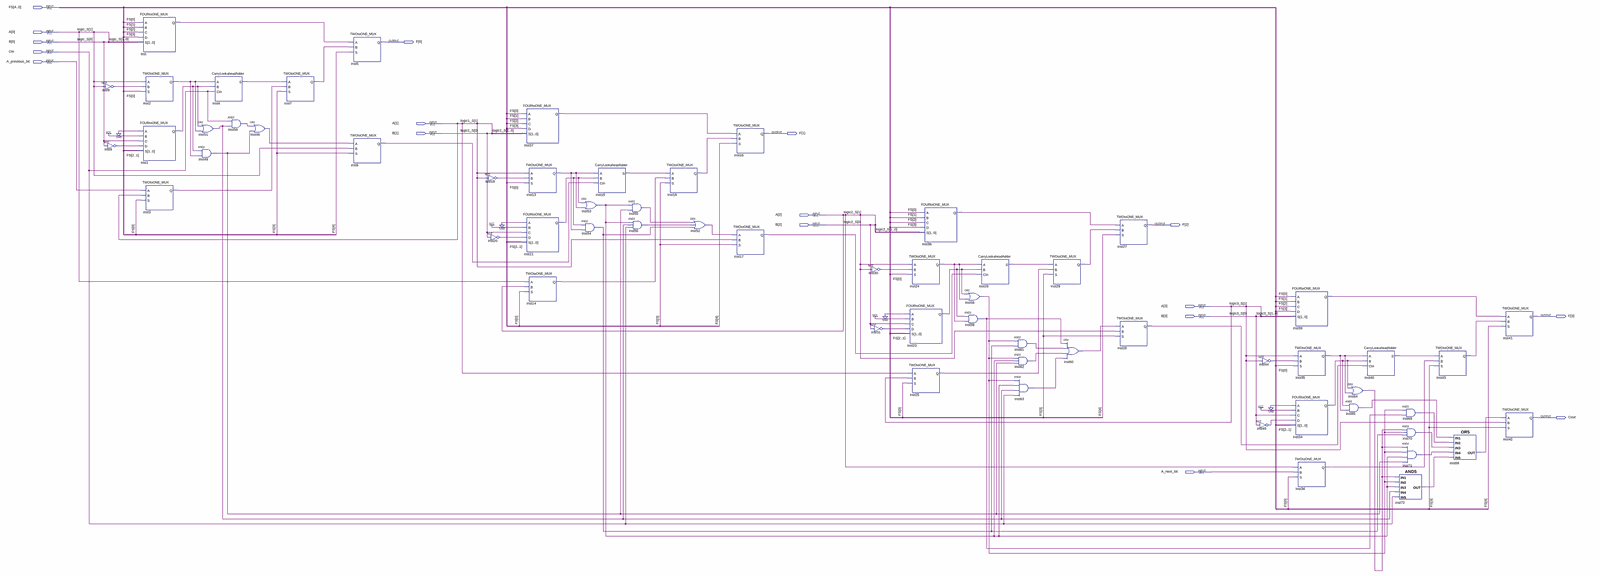
[diagram p0: schematic sheet, whole]
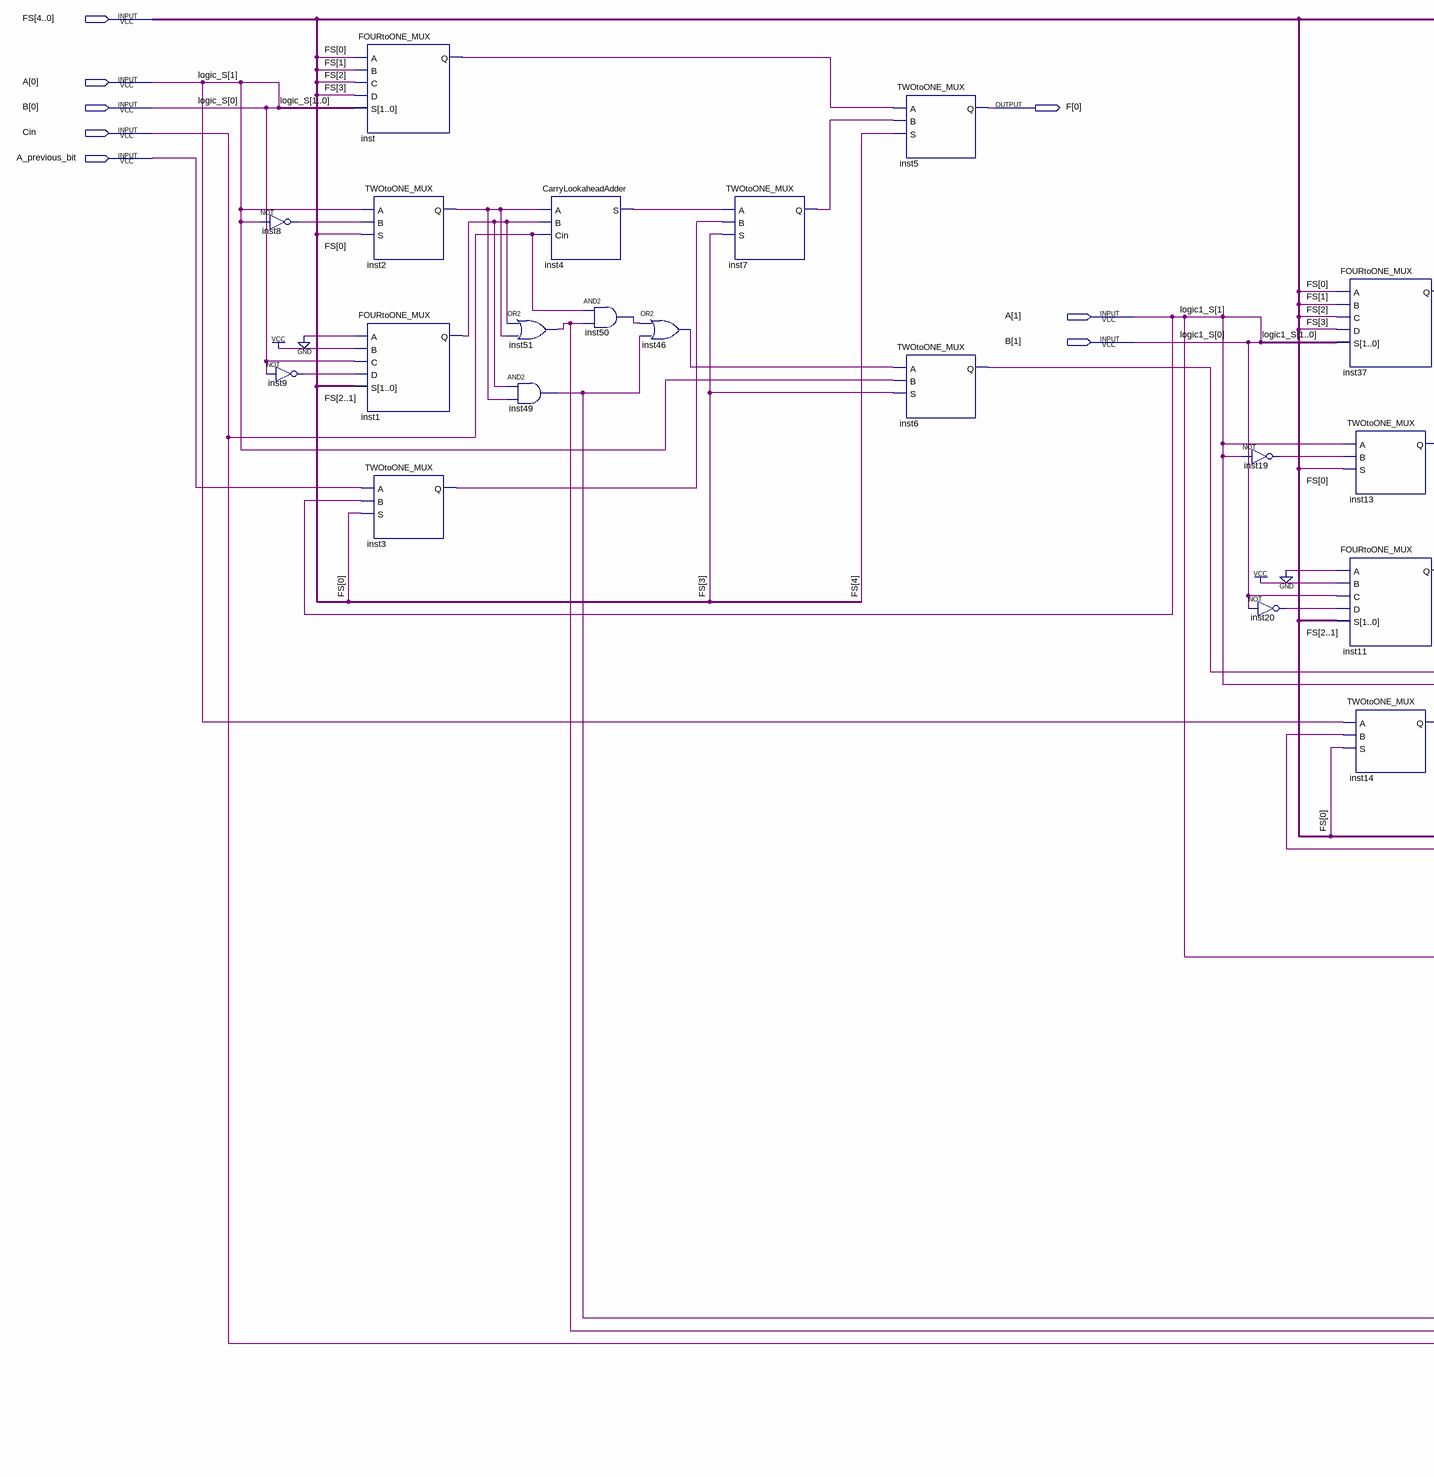
[diagram p1: schematic sheet, left part]
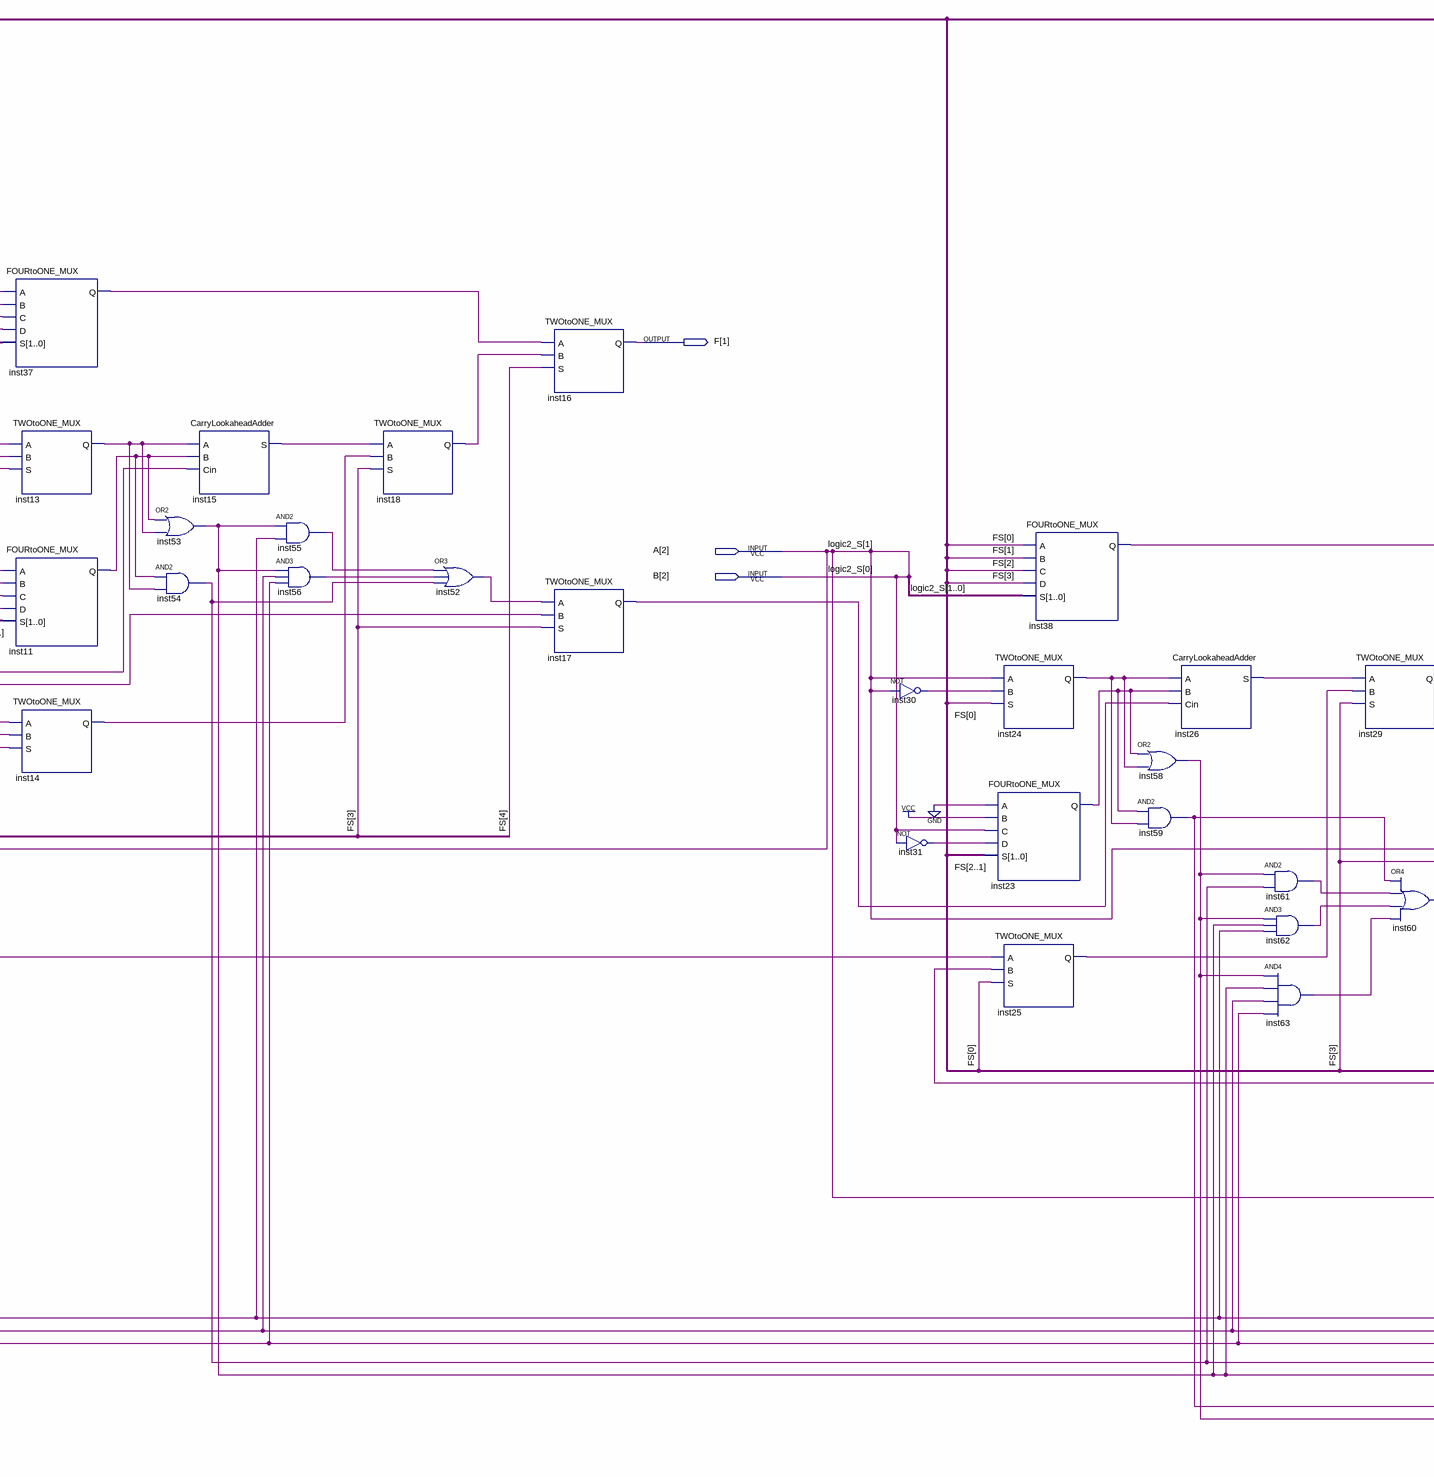
[diagram p2: schematic sheet, centre part]
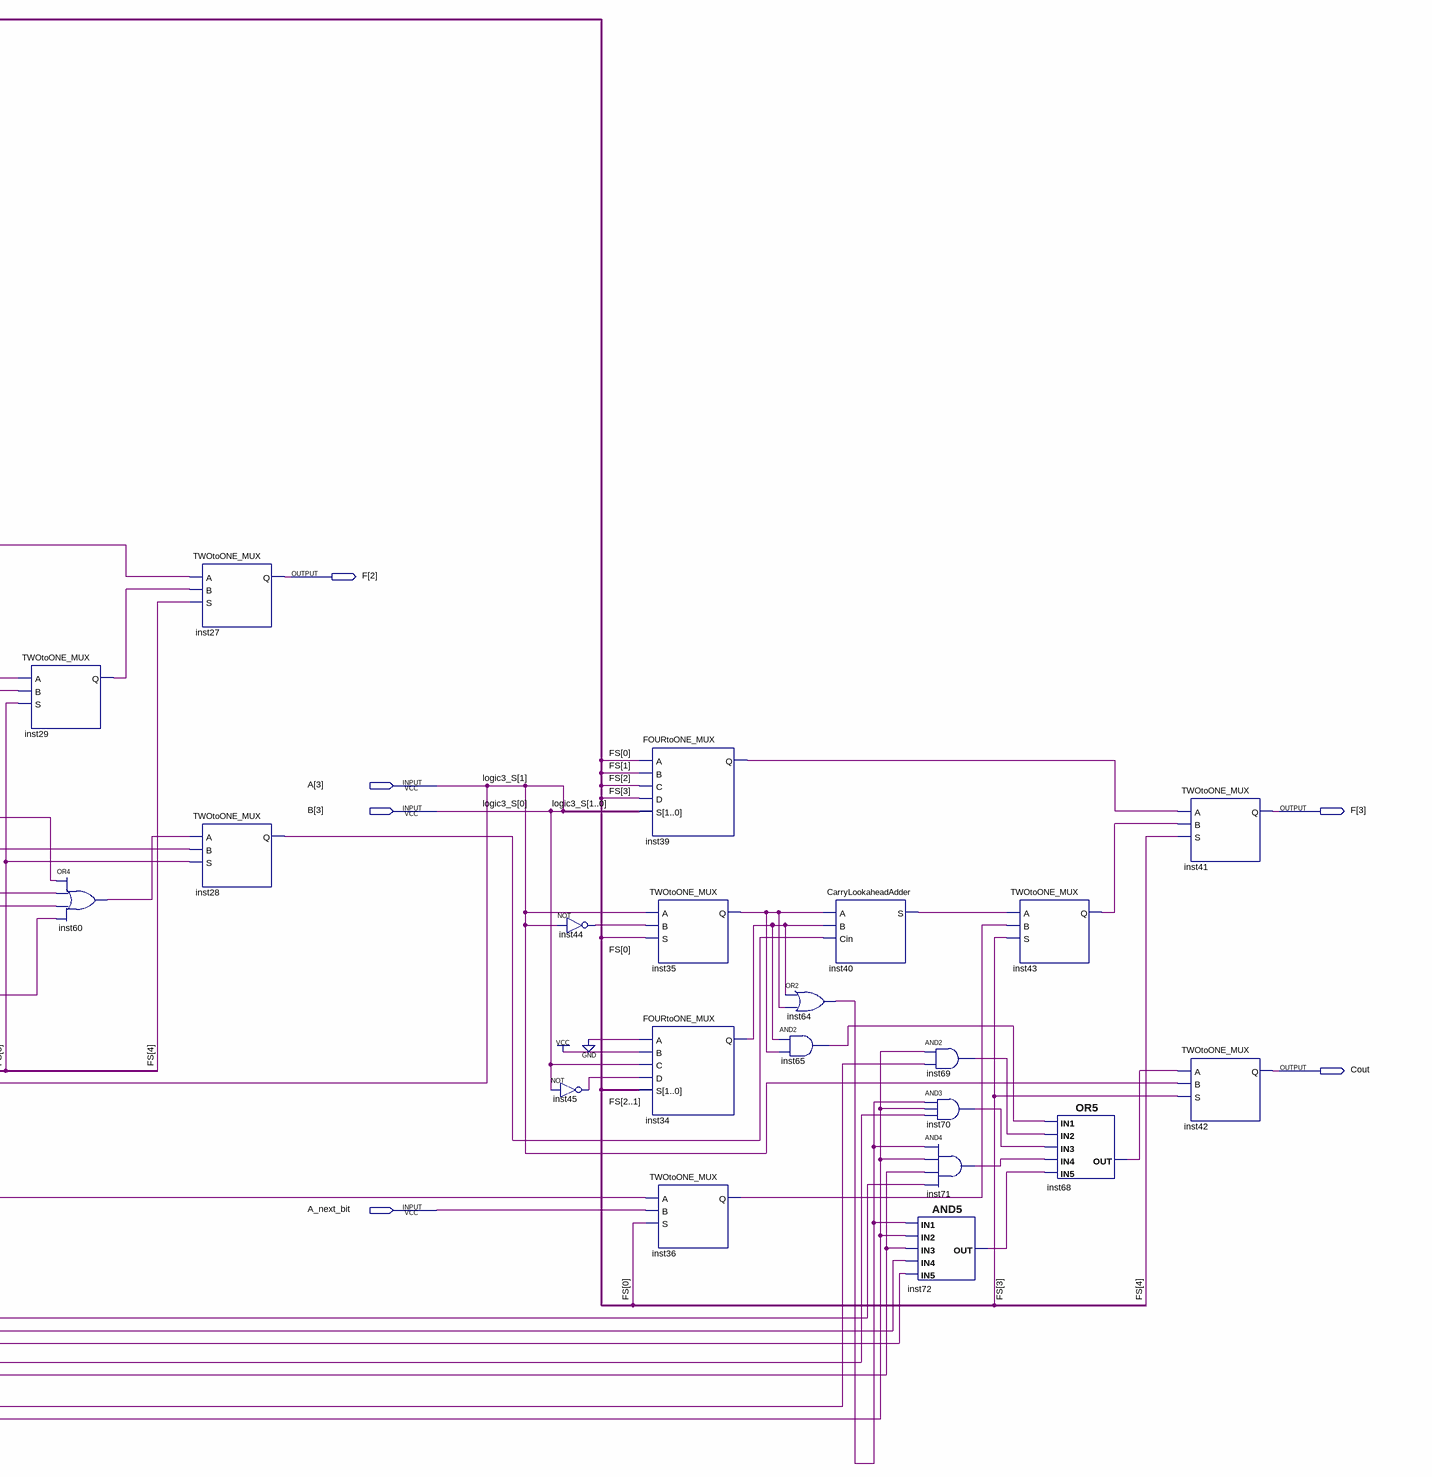
[diagram p3: schematic sheet, right part]
// Quartus schematic ALU_4bit.bdf as structural Verilog: 62 symbols, 17 pins
module ALU_4bit (
  input  [4:0] FS,
  input  [3:0] A,
  input  [3:0] B,
  input  Cin,
  input  A_previous_bit,
  input  A_next_bit,
  output [3:0] F,
  output Cout
);

  wire inst1_q, inst2_q, inst3_q, inst4_s, inst6_q, inst7_q, inst8_out, inst9_out, inst11_q, inst13_q,
       inst14_q, inst15_s, inst17_q, inst18_q, inst19_out, inst20_out, inst23_q, inst24_q, inst25_q,
       inst26_s, inst28_q, inst29_q, inst30_out, inst31_out, inst34_q, inst35_q, inst36_q, inst37_q,
       inst38_q, inst39_q, inst40_s, inst43_q, inst44_out, inst45_out, inst46_out, inst49_out, inst50_out,
       inst51_out, inst52_out, inst53_out, inst54_out, inst55_out, inst56_out, inst58_out, inst59_out,
       inst60_out, inst61_out, inst62_out, inst63_out, inst64_out, inst65_out, inst68_out, inst69_out,
       inst70_out, inst71_out, inst72_out, inst_q;

  not inst8 (inst8_out, A[0]);
  not inst9 (inst9_out, B[0]);
  FOURtoONE_MUX inst (.A(FS[0]), .B(FS[1]), .C(FS[2]), .D(FS[3]), .S({A[0], B[0]}), .Q(inst_q));
  TWOtoONE_MUX inst2 (.A(A[0]), .B(inst8_out), .S(FS[0]), .Q(inst2_q));
  FOURtoONE_MUX inst1 (.A(1'b0), .B(1'b1), .C(B[0]), .D(inst9_out), .S(FS[2:1]), .Q(inst1_q));
  TWOtoONE_MUX inst3 (.A(A_previous_bit), .B(A[1]), .S(FS[0]), .Q(inst3_q));
  or inst51 (inst51_out, inst1_q, inst2_q);
  and inst49 (inst49_out, inst1_q, inst2_q);
  CarryLookaheadAdder inst4 (.A(inst2_q), .B(inst1_q), .Cin(Cin), .S(inst4_s));
  and inst50 (inst50_out, Cin, inst51_out);
  or inst46 (inst46_out, inst50_out, inst49_out);
  TWOtoONE_MUX inst7 (.A(inst4_s), .B(inst3_q), .S(FS[3]), .Q(inst7_q));
  TWOtoONE_MUX inst5 (.A(inst_q), .B(inst7_q), .S(FS[4]), .Q(F[0]));
  TWOtoONE_MUX inst6 (.A(inst46_out), .B(A[0]), .S(FS[3]), .Q(inst6_q));
  not inst19 (inst19_out, A[1]);
  not inst20 (inst20_out, B[1]);
  FOURtoONE_MUX inst37 (.A(FS[0]), .B(FS[1]), .C(FS[2]), .D(FS[3]), .S({A[1], B[1]}), .Q(inst37_q));
  TWOtoONE_MUX inst13 (.A(A[1]), .B(inst19_out), .S(FS[0]), .Q(inst13_q));
  FOURtoONE_MUX inst11 (.A(1'b0), .B(1'b1), .C(B[1]), .D(inst20_out), .S(FS[2:1]), .Q(inst11_q));
  TWOtoONE_MUX inst14 (.A(A[0]), .B(A[2]), .S(FS[0]), .Q(inst14_q));
  CarryLookaheadAdder inst15 (.A(inst13_q), .B(inst11_q), .Cin(inst6_q), .S(inst15_s));
  or inst53 (inst53_out, inst11_q, inst13_q);
  and inst54 (inst54_out, inst11_q, inst13_q);
  and inst55 (inst55_out, inst53_out, inst49_out);
  and inst56 (inst56_out, inst53_out, inst51_out, Cin);
  TWOtoONE_MUX inst18 (.A(inst15_s), .B(inst14_q), .S(FS[3]), .Q(inst18_q));
  or inst52 (inst52_out, inst55_out, inst56_out, inst54_out);
  TWOtoONE_MUX inst16 (.A(inst37_q), .B(inst18_q), .S(FS[4]), .Q(F[1]));
  TWOtoONE_MUX inst17 (.A(inst52_out), .B(A[1]), .S(FS[3]), .Q(inst17_q));
  not inst30 (inst30_out, A[2]);
  not inst31 (inst31_out, B[2]);
  TWOtoONE_MUX inst24 (.A(A[2]), .B(inst30_out), .S(FS[0]), .Q(inst24_q));
  FOURtoONE_MUX inst23 (.A(1'b0), .B(1'b1), .C(B[2]), .D(inst31_out), .S(FS[2:1]), .Q(inst23_q));
  TWOtoONE_MUX inst25 (.A(A[1]), .B(A[3]), .S(FS[0]), .Q(inst25_q));
  FOURtoONE_MUX inst38 (.A(FS[0]), .B(FS[1]), .C(FS[2]), .D(FS[3]), .S({A[2], B[2]}), .Q(inst38_q));
  or inst58 (inst58_out, inst23_q, inst24_q);
  and inst59 (inst59_out, inst23_q, inst24_q);
  CarryLookaheadAdder inst26 (.A(inst24_q), .B(inst23_q), .Cin(inst17_q), .S(inst26_s));
  and inst61 (inst61_out, inst58_out, inst54_out);
  and inst62 (inst62_out, inst58_out, inst53_out, inst49_out);
  and inst63 (inst63_out, inst58_out, inst53_out, inst51_out, Cin);
  TWOtoONE_MUX inst29 (.A(inst26_s), .B(inst25_q), .S(FS[3]), .Q(inst29_q));
  or inst60 (inst60_out, inst59_out, inst61_out, inst62_out, inst63_out);
  TWOtoONE_MUX inst27 (.A(inst38_q), .B(inst29_q), .S(FS[4]), .Q(F[2]));
  TWOtoONE_MUX inst28 (.A(inst60_out), .B(A[2]), .S(FS[3]), .Q(inst28_q));
  not inst44 (inst44_out, A[3]);
  not inst45 (inst45_out, B[3]);
  FOURtoONE_MUX inst39 (.A(FS[0]), .B(FS[1]), .C(FS[2]), .D(FS[3]), .S({A[3], B[3]}), .Q(inst39_q));
  FOURtoONE_MUX inst34 (.A(1'b0), .B(1'b1), .C(B[3]), .D(inst45_out), .S(FS[2:1]), .Q(inst34_q));
  TWOtoONE_MUX inst35 (.A(A[3]), .B(inst44_out), .S(FS[0]), .Q(inst35_q));
  TWOtoONE_MUX inst36 (.A(A[2]), .B(A_next_bit), .S(FS[0]), .Q(inst36_q));
  or inst64 (inst64_out, inst34_q, inst35_q);
  and inst65 (inst65_out, inst34_q, inst35_q);
  CarryLookaheadAdder inst40 (.A(inst35_q), .B(inst34_q), .Cin(inst28_q), .S(inst40_s));
  and inst69 (inst69_out, inst58_out, inst59_out);
  and inst70 (inst70_out, inst64_out, inst58_out, inst54_out);
  and inst71 (inst71_out, inst64_out, inst58_out, inst53_out, inst49_out);
  and inst72 (inst72_out, inst64_out, inst58_out, inst53_out, inst51_out, Cin);
  TWOtoONE_MUX inst43 (.A(inst40_s), .B(inst36_q), .S(FS[3]), .Q(inst43_q));
  or inst68 (inst68_out, inst65_out, inst69_out, inst70_out, inst71_out, inst72_out);
  TWOtoONE_MUX inst41 (.A(inst39_q), .B(inst43_q), .S(FS[4]), .Q(F[3]));
  TWOtoONE_MUX inst42 (.A(inst68_out), .B(A[3]), .S(FS[3]), .Q(Cout));

  // Other names for the same wires on the sheet: logic_S[1:0] = {A[0], B[0]}; logic1_S[1:0] = {A[1], B[1]};
  //   logic2_S[1:0] = {A[2], B[2]}; logic3_S[1:0] = {A[3], B[3]}
endmodule
